# Altium schematic sheet usb_ft231.SchDoc: USB - UART Interface
size A4
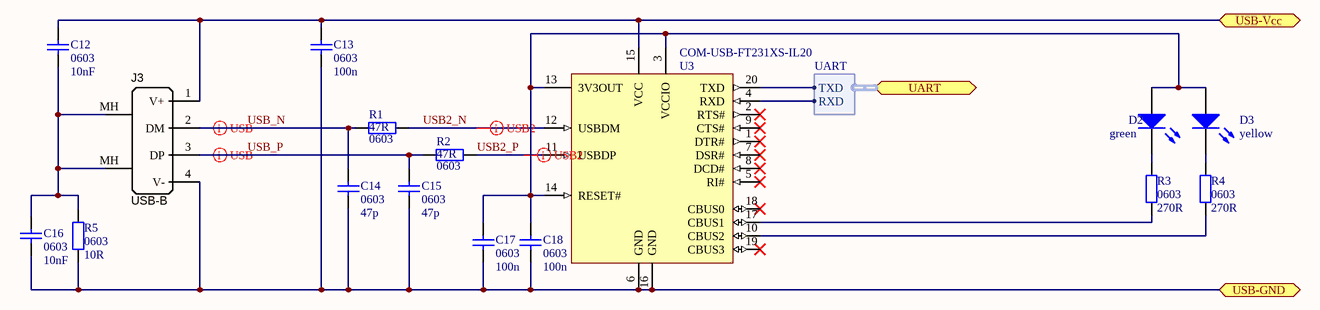
[diagram p0: usb_ft231.SchDoc]

## Parts
C12  0603  value 10nF  [SMD_Capacitor_0603]
C13  0603  value 100n  [SMD_Capacitor_0603]
C14  0603  value 47p  [SMD_Capacitor_0603]
C15  0603  value 47p  [SMD_Capacitor_0603]
C16  0603  value 10nF  [SMD_Capacitor_0603]
C17  0603  value 100n  [SMD_Capacitor_0603]
C18  0603  value 100n  [SMD_Capacitor_0603]
D2  green  [LED 0805 GREEN]
D3  yellow  [LED 0805 Yellow]
J3  USB-B  [USB_TypeB_Tyco]
R1  0603  value 47R  [SMD_Resistor_0603]
R2  0603  value 47R  [SMD_Resistor_0603]
R3  0603  value 270R  [SMD_Resistor_0603]
R4  0603  value 270R  [SMD_Resistor_0603]
R5  0603  value 10R  [SMD_Resistor_0603]
U3  COM-USB-FT231XS-IL20  [SSOP-20_L]

## Ports
UART (harness UART), USB-GND, USB-Vcc

## Harnesses
UART: RXD, TXD

## Nets
USB2_N: R1.2 U3.12(USBDM)
USB2_P: R2.2 U3.11(USBDP)
USB-GND: C13.2 C14.1 C15.1 C16.2 C17.2 C18.1 J3.4(V-) R5.1 U3.6(GND) U3.16(GND) ; port USB-GND
USB-Vcc: C12.1 C13.1 J3.1(V+) U3.15(VCC) ; port USB-Vcc
USB_N: C14.2 J3.2(DM) R1.1
USB_P: C15.2 J3.3(DP) R2.1
NetC12_2: C12.2 C16.1 J3.MH(Shell) R5.2
NetC17_1: C17.1 C18.2 D2.1(A) D3.1(A) U3.3(VCCIO) U3.13(3V3OUT) U3.14(RESET#)
NetD2_2: D2.2(K) R3.2
NetD3_2: D3.2(K) R4.2
NetR3_1: R3.1 U3.17(CBUS1)
NetR4_1: R4.1 U3.10(CBUS2)
NetU3_4: U3.4(RXD) ; port UART.RXD
NetU3_20: U3.20(TXD) ; port UART.TXD

Not connected (* = marked no-connect by the designer): U3 1(DTR#)* 2(RTS#)* 5(RI#)* 7(DSR#)* 8(DCD#)* 9(CTS#)* 18(CBUS0)* 19(CBUS3)*

## Layout directives
differential pair: USB2_N, USB2_P, USB_N, USB_P

## Notes on the sheet
- Title:
- Sheet:
- of
- Author:
- Model:
- Document Number:
- Checked by:
- Iss-Rev:
- Approved by:
- Date:
- File name:

## Library data of the parts
C12-C18 = Cap: Capacitor; Published: 8-Jun-2000; LatestRevisionDate: 17-Jul-2002; LatestRevisionNote: Re-released for DXP Platform.; PackageReference: RAD-0.3; Publisher: Altium Limited; PackageDescription: Radial Cap, Thru-Hole; 2 Leads; 0.3 in Pin Spacing
D2 D3 = LED2: Typical RED, GREEN, YELLOW, AMBER GaAs LED; Published: 8-Jun-2000; LatestRevisionDate: 17-Jul-2002; LatestRevisionNote: Re-released for DXP Platform.; PackageVersion: Feb-2002; PackageReference: 3.2X1.6X1.1; Publisher: Altium Limited; PackageDescription: SM LED; 2 Flat Leads
J3 = USB_TypeB: Connector THT Type B USB connector; Manufacturer Part Number 1: 292304-1; Manufacturer 1: TE Connectivity; Specifications: USB 2.0; SCDType: undef; Package / Case: R/A Type B; Supplier 1: Digi-Key; Connector Type: USB - B; Supplier Part Number 1: A31725-ND
R1-R5 = Res2: Resistor; Published: 8-Jun-2000; LatestRevisionDate: 17-Jul-2002; LatestRevisionNote: Re-released for DXP Platform.; PackageReference: AXIAL-0.4; Publisher: Altium Limited; PackageDescription: Axial Device, Thru-Hole; 2 Leads; 0.4 in Pin Spacing